# EAGLE design SICK_GL6_P0511S21 (EAGLE 9.4.0)
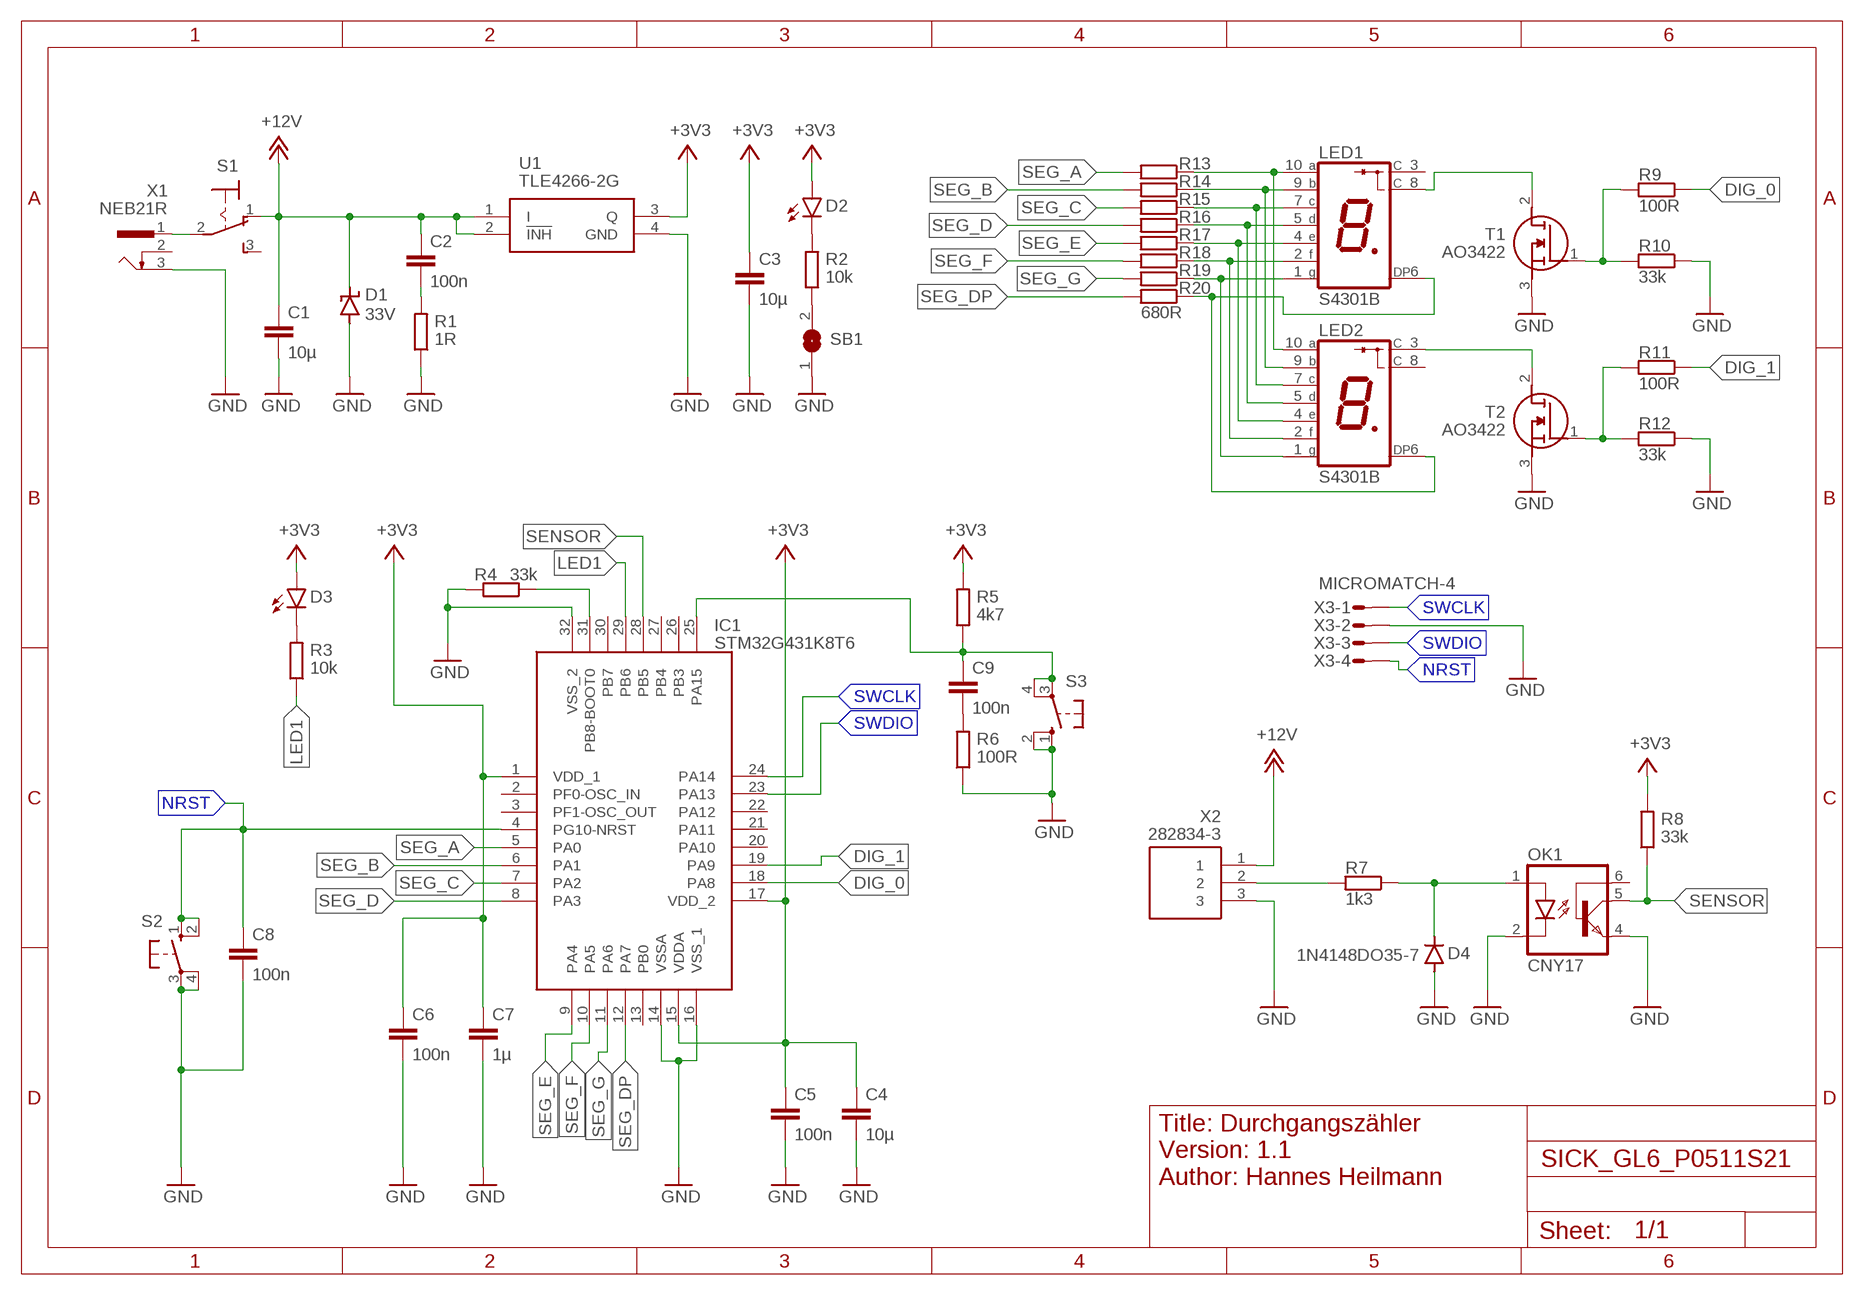
[diagram p0: schematic, sheet 1]

## Parts
C1  10µ  C-EUC1206K  [C1206K]
C2  100n  C-EUC0805K  [C0805K]
C3  10µ  C-EUC1206K  [C1206K]
C4  10µ  C-EUC1206K  [C1206K]
C5  100n  C-EUC0805K  [C0805K]
C6  100n  C-EUC0805K  [C0805K]
C7  1µ  C-EUC1206K  [C1206K]
C8  100n  C-EUC0805K  [C0805K]
C9  100n  C-EUC0805K  [C0805K]
D1  33V  SUPPRESSOR-SMBJ  [SMBJ]
D2  LEDSML0805  [SML0805]
D3  LEDSML0805  [SML0805]
D4  1N4148DO35-7  [DO35-7]
IC1  STM32G431K8T6  [QFP80P900X900X160-32N]
LED1  S4301B  [S4301B]
LED2  S4301B  [S4301B]
OK1  CNY17  [DIL06]
R1  1R  R-EU_R0805  [R0805]
R2  10k  R-EU_R0805  [R0805]
R3  10k  R-EU_R0805  [R0805]
R4  33k  R-EU_R0805  [R0805]
R5  4k7  R-EU_R0805  [R0805]
R6  100R  R-EU_R0805  [R0805]
R7  1k3  R-EU_R0805  [R0805]
R8  33k  R-EU_R0805  [R0805]
R9  100R  R-EU_R0805  [R0805]
R10  33k  R-EU_R0805  [R0805]
R11  100R  R-EU_R0805  [R0805]
R12  33k  R-EU_R0805  [R0805]
R13  680R  R-EU_R0805  [R0805]
R14  680R  R-EU_R0805  [R0805]
R15  680R  R-EU_R0805  [R0805]
R16  680R  R-EU_R0805  [R0805]
R17  680R  R-EU_R0805  [R0805]
R18  680R  R-EU_R0805  [R0805]
R19  680R  R-EU_R0805  [R0805]
R20  680R  R-EU_R0805  [R0805]
S1  M9040P  [M9040P]
S2  10-XX  [B3F-10XX]
S3  10-XX  [B3F-10XX]
SB1  SJ  [SJ]
T1  AO3422  [SOT95P237X112-3N]
T2  AO3422  [SOT95P237X112-3N]
U1  TLE4266-2G  [SOT230P700X170-4N]
X1  NEB21R  [NEB21R]
X2  282834-3  [SHDR3W100P0X254_1X3_808X650X10]
X3  MICROMATCH-4  [MICROMATCH-4]

## Nets
+3V3: C3.1 C4.1 C5.1 C6.1 C7.1 D2.A D3.A IC1.1(VDD_1) IC1.15(VDDA) IC1.17(VDD_2) R5.2 R8.2 U1.3(Q)
+12V: C1.1 C2.1 D1.C S1.1(O) U1.1(I) U1.2(!INH) X2.1
DIG_0: IC1.18(PA8) R9.1
DIG_1: IC1.19(PA9) R11.1
GND: C1.2 C3.2 C4.2 C5.2 C6.2 C7.2 C8.2 D1.A D4.A IC1.14(VSSA) IC1.16(VSS_1) IC1.32(VSS_2) OK1.2(C) OK1.4(EMI) R1.1 R4.2 R6.1 R10.1 R12.1 S2.3(P) S2.4(P1) S3.1(S) S3.2(S1) SB1.1 T1.3(S) T2.3(S) U1.4(GND) X1.3 X2.3 X3.2
LED1: IC1.29(PB6) R3.1
N$1: S1.2(P) X1.1
N$2: C2.2 R1.2
N$3: D4.C OK1.1(A) R7.1
N$4: LED2.3(C) T2.2(D)
N$5: D2.C R2.2
N$6: R7.2 X2.2
N$7: C9.1 IC1.25(PA15) R5.1 S3.3(P) S3.4(P1)
N$8: C9.2 R6.2
N$9: LED1.8(C) T1.2(D)
N$10: IC1.31(PB8-BOOT0) R4.1
N$11: R2.1 SB1.2
N$12: R11.2 R12.2 T2.1(G)
N$13: R9.2 R10.2 T1.1(G)
N$14: D3.C R3.2
NRST: C8.1 IC1.4(PG10-NRST) S2.1(S) S2.2(S1) X3.4
S_A: LED1.10(A) LED2.10(A) R13.1
S_B: LED1.9(B) LED2.9(B) R14.1
S_C: LED1.7(C) LED2.7(C) R15.1
S_D: LED1.5(D) LED2.5(D) R16.1
S_DP: LED1.6(DP) LED2.6(DP) R20.1
S_E: LED1.4(E) LED2.4(E) R17.1
S_F: LED1.2(F) LED2.2(F) R18.1
S_G: LED1.1(G) LED2.1(G) R19.1
SEG_A: IC1.5(PA0) R13.2
SEG_B: IC1.6(PA1) R14.2
SEG_C: IC1.7(PA2) R15.2
SEG_D: IC1.8(PA3) R16.2
SEG_DP: IC1.12(PA7) R20.2
SEG_E: IC1.9(PA4) R17.2
SEG_F: IC1.10(PA5) R18.2
SEG_G: IC1.11(PA6) R19.2
SENSOR: IC1.28(PB5) OK1.5(COL) R8.1
SWCLK: IC1.24(PA14) X3.1
SWDIO: IC1.23(PA13) X3.3
Unconnected: IC1.2(PF0-OSC_IN) IC1.3(PF1-OSC_OUT) IC1.13(PB0) IC1.20(PA10) IC1.21(PA11) IC1.22(PA12) IC1.26(PB3) IC1.27(PB4) IC1.30(PB7) LED1.3(C) LED2.8(C) OK1.6(BAS) S1.3(S) X1.2

## Notes on the sheet
- Title: Durchgangszähler
  Version: 1.1
  Author: Hannes Heilmann

## Library data of the parts
C1-C9 = rcl:C-EU: CAPACITOR, European symbol; SPICEPREFIX: C
D1 = diode:SUPPRESSOR-: Suppressor diode
D2 D3 = led:LED: LED OSRAM: - CHIPLED LG R971, LG N971, LY N971, LG Q971, LY Q971, LO R971, LY R971 LH N974, LH R974 LS Q976, LO Q976, LY Q976 LO Q996 - Hyper CHIPLED LW Q18S LB Q993, LB Q99A, LB R99A - SideLED LS A670, LO A670, LY A670, LG A670, LP A670 LB A673, LV A673, LT A673, LW A673 LH A674 LY A675 LS A676, LA A676, LO A676, LY A676, LW A676 LS A679, LY A679, LG A679 - Hyper Micro SIDELED® LS Y876, LA Y876, LO Y876, LY Y876 LT Y87S - SmartLED LW L88C, LW L88S LB L89C, LB L89S, LG L890 LS L89K, LO L89K, LY L89K LS L896, LA L896, LO L896, LY L896 - TOPLED LS T670, LO T670, LY T670, LG T670, LP T670 LSG T670, LSP T670, LSY T670, LOP T670, LYG T670 LG T671, LOG T671, LSG T671 LB T673, LV T673, LT T673, LW T673 LH T674 LS T676, LA T676, LO T676, LY T676, LB T676, LH T676, LSB T676, LW T676 LB T67C, LV T67C, LT T67C, LS T67K, LO T67K, LY T67K, LW E67C LS E67B, LA E67B, LO E67B, LY E67B, LB E67C, LV E67C, LT E67C LW T67C LS T679, LY T679, LG T679 LS T770, LO T770, LY T770, LG T770, LP T770 LB T773, LV T773, LT T773, LW T773 LH T774 LS E675, LA E675, LY E675, LS T675 LS T776, LA T776, LO T776, LY T776, LB T776 LHGB T686 LT T68C, LB T68C - Hyper Mini TOPLED® LB M676 - Mini TOPLED Santana® LG M470 LS M47K, LO M47K, LY M47K Source: http://www.osram.convergy.de LUXEON: - LUMILED® LXK2-PW12-R00, LXK2-PW12-S00, LXK2-PW14-U00, LXK2-PW14-V00 LXK2-PM12-R00, LXK2-PM12-S00, LXK2-PM14-U00 LXK2-PE12-Q00, LXK2-PE12-R00, LXK2-PE12-S00, LXK2-PE14-T00, LXK2-PE14-U00 LXK2-PB12-K00, LXK2-PB12-L00, LXK2-PB12-M00, LXK2-PB14-N00, LXK2-PB14-P00, LXK2-PB14-Q00 LXK2-PR12-L00, LXK2-PR12-M00, LXK2-PR14-Q00, LXK2-PR14-R00 LXK2-PD12-Q00, LXK2-PD12-R00, LXK2-PD12-S00 LXK2-PH12-R00, LXK2-PH12-S00 LXK2-PL12-P00, LXK2-PL12-Q00, LXK2-PL12-R00 Source: www.luxeon.com KINGBRIGHT: KA-3528ASYC Source: www.kingbright.com
D4 = diode:1N4148: DIODE high speed (Philips)
IC1 = SamacSys_Parts:STM32G431K8T6: STMICROELECTRONICS - STM32G431K8T6 - ARM MCU, STM32 Family STM32G4 Series Microcontrollers, ARM Cortex-M4F, 32bit, 170 MHz, 64 KB, 32 KB Source: Datasheet <https://www.st.com/resource/en/datasheet/stm32g431c6.pdf>; ARROW_PART_NUMBER: STM32G431K8T6; ARROW_PRICE-STOCK: https://www.arrow.com/en/products/stm32g431k8t6/stmicroelectronics; DESCRIPTION: STMICROELECTRONICS - STM32G431K8T6 - ARM MCU, STM32 Family STM32G4 Series Microcontrollers, ARM Cortex-M4F, 32bit, 170 MHz, 64 KB, 32 KB; HEIGHT: 1.6mm; MANUFACTURER_NAME: STMicroelectronics; MANUFACTURER_PART_NUMBER: STM32G431K8T6; MOUSER_PART_NUMBER: 511-STM32G431K8T6; MOUSER_PRICE-STOCK: https://www.mouser.co.uk/ProductDetail/STMicroelectronics/STM32G431K8T6?qs=uwxL4vQweFOdPzJwuo6fkQ%3D%3D
LED1 LED2 = led-7-segment:S4301B: Single Digit Seven-Segment Display (cathode common) Source: LITEON .. S4301B.pdf; OC_FARNELL: unknown; OC_NEWARK: unknown
OK1 = optocoupler:CNY17: SIEMENS OPTO COUPLER; MPN: CNY17-1; OC_FARNELL: 1045399; OC_NEWARK: 05M4044
R1-R20 = rcl:R-EU_: RESISTOR, European symbol; SPICEPREFIX: R
S1 = switch:M9040P: TOGGLE SWITCH Marquardt
S2 S3 = switch-omron:10-XX: OMRON SWITCH; MPN: B3F-1000; OC_FARNELL: 176432; OC_NEWARK: 36M3542
SB1 = jumper:SJ: SMD solder JUMPER
T1 T2 = SamacSys_Parts:AO3422: MOSFET N-CH 55V 2.1A SOT23 Source: Datasheet <http://aosmd.com/res/data_sheets/AO3422.pdf>; ARROW_PART_NUMBER: AO3422; ARROW_PRICE-STOCK: https://www.arrow.com/en/products/ao3422/alpha-and-omega-semiconductor?region=nac; DESCRIPTION: MOSFET N-CH 55V 2.1A SOT23; HEIGHT: 1.12mm; MANUFACTURER_NAME: Alpha & Omega Semiconductors; MANUFACTURER_PART_NUMBER: AO3422
U1 = SamacSys_Parts:TLE4266-2G: Infineon TLE4266-2G, LDO Voltage Regulator, 150mA, 5 V +/-3%, 5.5 45 Vin, 3+Tab-Pin SOT-223 Source: Datasheet <http://www.infineon.com/dgdl/Infineon-TLE4266-2-DS-v01_40-EN.pdf?fileId=5546d46259d9a4bf0159f94369cf3e1b>; DESCRIPTION: Infineon TLE4266-2G, LDO Voltage Regulator, 150mA, 5 V +/-3%, 5.5 45 Vin, 3+Tab-Pin SOT-223; HEIGHT: 1.7mm; MANUFACTURER_NAME: Infineon; MANUFACTURER_PART_NUMBER: TLE4266-2G; MOUSER_PART_NUMBER: 726-TLE42662G; MOUSER_PRICE-STOCK: https://www.mouser.com/Search/Refine.aspx?Keyword=726-TLE42662G
X1 = SamacSys_Parts:NEB21R: Netzgeräte-Einbaukupplung abgewinkelte Ausführung mit Öffner Source: http://www.lumberg.com/Produkte/PDFs/NEB21R.pdf; MPN: NEB 21 R; OC_FARNELL: 1217037; OC_NEWARK: 97K6458
X2 = SamacSys_Parts:282834-3: Connector pcb 3 way 2.54mm Termi-Block Source: Datasheet <http://www.te.com/commerce/DocumentDelivery/DDEController?Action=showdoc&DocId=Customer Drawing282834C1pdfEnglishENG_CD_282834_C1.pdf282834-3>; ALLIED_NUMBER: 70087777; ALLIED_PRICE-STOCK: http://www.alliedelec.com/te-connectivity-282834-3/70087777/; DESCRIPTION: Connector pcb 3 way 2.54mm Termi-Block; HEIGHT: 10.3mm; MANUFACTURER_NAME: TE Connectivity; MANUFACTURER_PART_NUMBER: 282834-3; MOUSER_PART_NUMBER: 571-2828343; MOUSER_PRICE-STOCK: https://www.mouser.com/Search/Refine.aspx?Keyword=571-2828343; RS_PART_NUMBER: 1640792; RS_PRICE-STOCK: http://uk.rs-online.com/web/p/products/1640792
X3 = con-amp-micromatch:MICROMATCH-4: MicroMaTch 4 7-215464-4 / 0-215464-4 Drawing Number C-215464 DDEController.pdf; MPN: 7-215464-4; OC_FARNELL: 3784629; OC_NEWARK: 19R8124

## Board
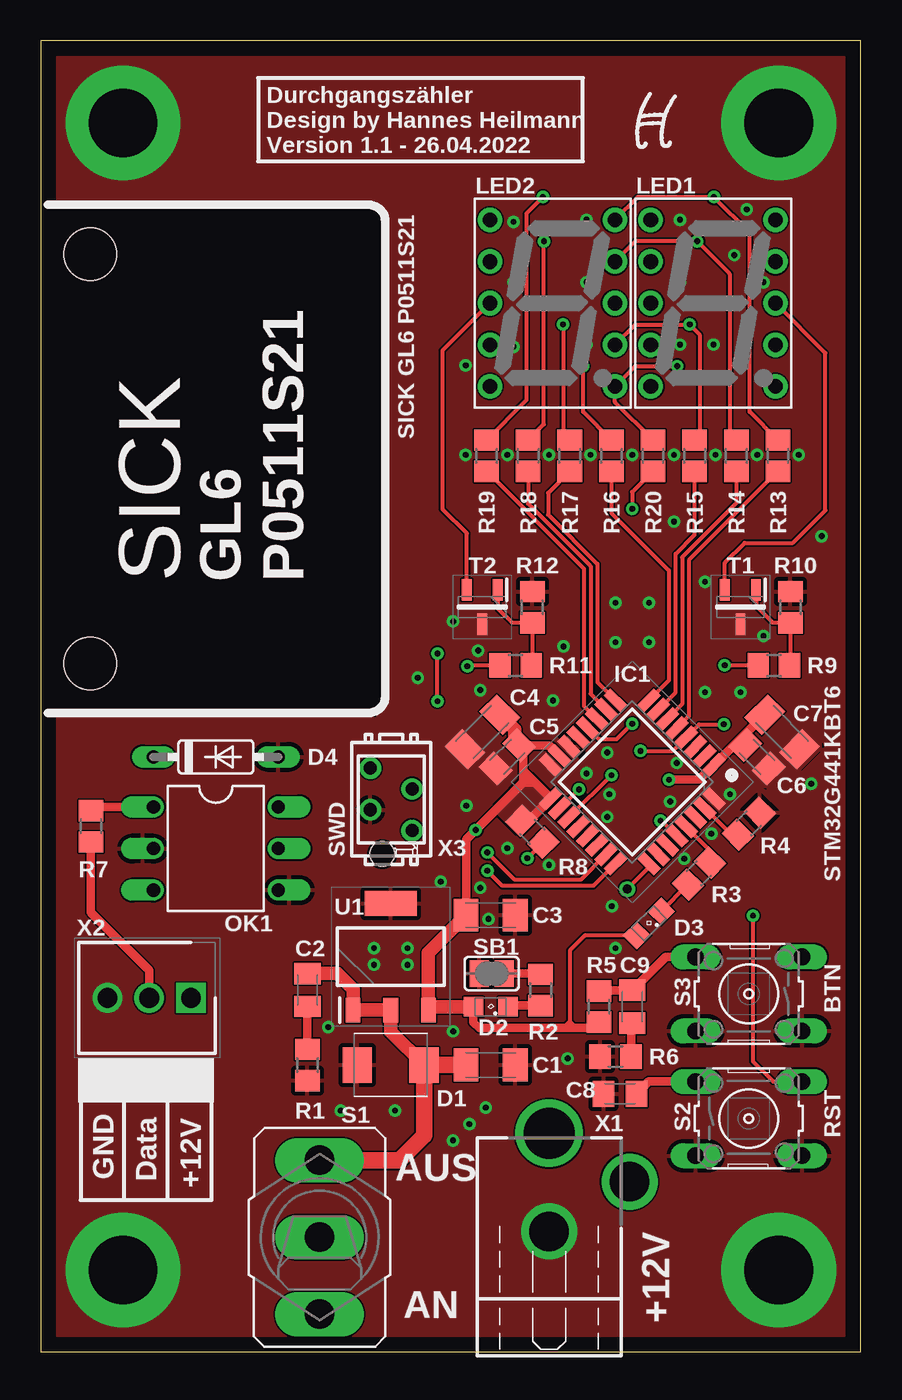
[diagram p1: board, top side]
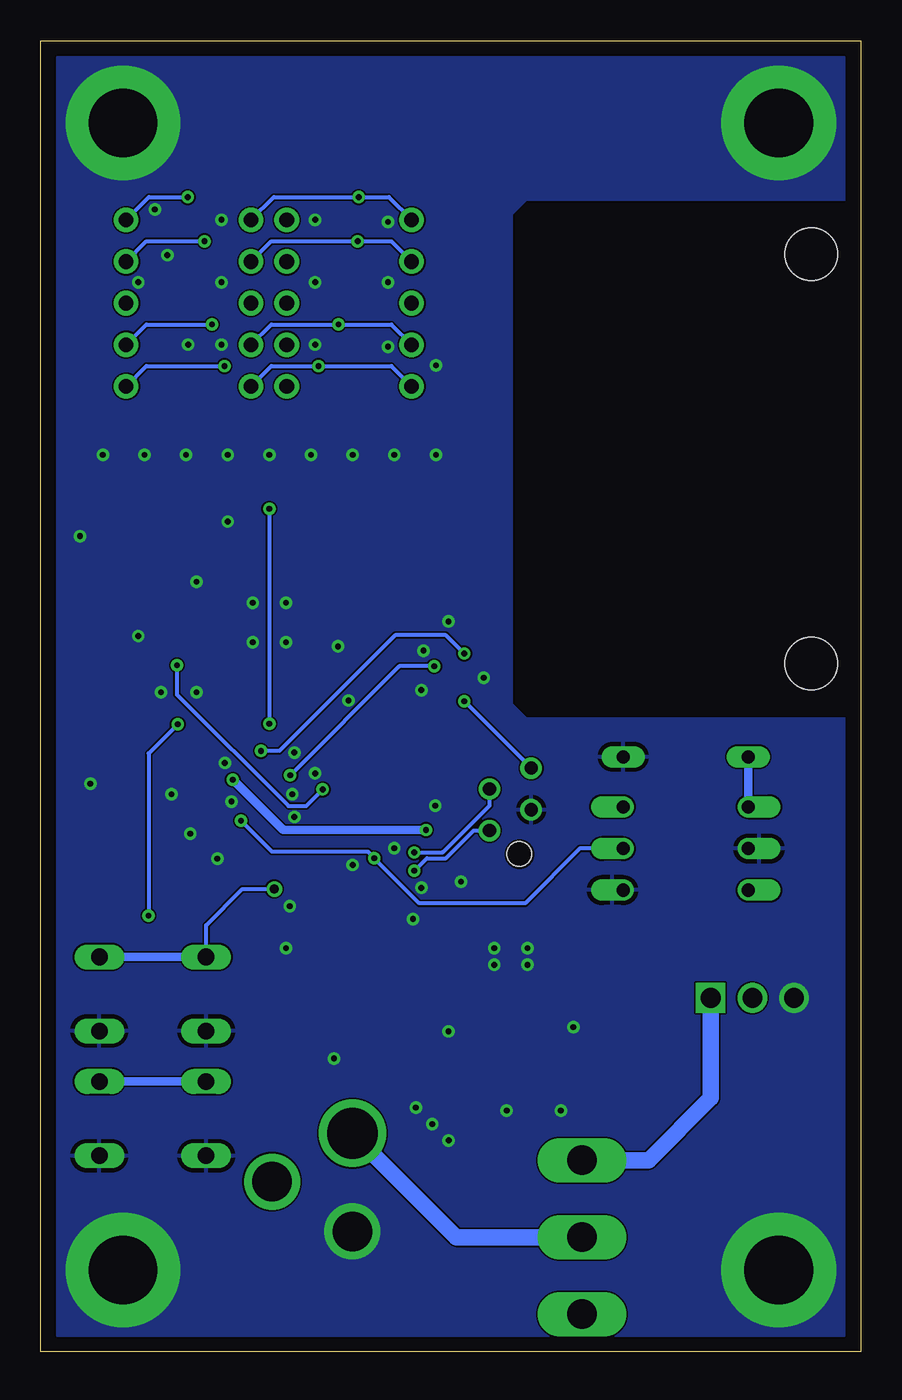
[diagram p2: board, bottom side, seen from below]

Size 50 x 80 mm. Coordinates in mm from the lower left corner, seen from the top.
Outline: 0,80 0,0 50,0 50,80 0,80
Copper layers (1*16): Top 0.035mm / dielectric 1.5mm / Bottom 0.035mm
Design rules "default *": minimum track width 2mil, minimum drill 0.35mm, track to track 4mil, track to pad 4mil, pad to pad 4mil, via to via 4mil, smd to smd 4mil, copper to edge 6mil, drill to drill 2mil, minimum pad ring 10mil, minimum via ring 8mil, stop-mask expansion 2mil, vias tented up to drill 0mil, thermal gap 10mil
Holes 3.2 mm at 3,67 3,42
tRestrict: area 0.8,38.9 to 21.1,70.1
bRestrict: area 0.8,38.9 to 21.1,70.1

### Footprints (pad centres in the part's own frame; a part is rotated, then mirrored left to right if it is on the bottom)
C1206K = smd 1.5 x 2: 1 -1.5,0; 2 1.5,0
C0805K = smd 1.3 x 1.6: 1 -1,0; 2 1,0
SMBJ = smd 1.78 x 2.16: A 2.04,0; C -2.03,0
SML0805 = smd 1.2 x 1.2: A 1.05,0; C -1.05,0
DO35-7 = drill 0.813 long: A 3.81,0; C -3.81,0
QFP80P900X900X160-32N = smd 1.475 x 0.6: 1 -4.238,2.8; 2 -4.238,2; 3 -4.238,1.2; 4 -4.238,0.4; 5 -4.238,-0.4; 6 -4.238,-1.2; 7 -4.238,-2; 8 -4.238,-2.8; 17 4.238,-2.8; 18 4.238,-2; 19 4.238,-1.2; 20 4.238,-0.4; 21 4.238,0.4; 22 4.238,1.2; 23 4.238,2; 24 4.238,2.8 | smd 0.6 x 1.475: 9 -2.8,-4.238; 10 -2,-4.238; 11 -1.2,-4.238; 12 -0.4,-4.238; 13 0.4,-4.238; 14 1.2,-4.238; 15 2,-4.238; 16 2.8,-4.238; 25 2.8,4.238; 26 2,4.238; 27 1.2,4.238; 28 0.4,4.238; 29 -0.4,4.238; 30 -1.2,4.238; 31 -2,4.238; 32 -2.8,4.238
S4301B = drill 0.9 pad 1.5: 1 -3.81,5.08; 2 -3.81,2.54; 3 -3.81,0; 4 -3.81,-2.54; 5 -3.81,-5.08; 6 3.81,-5.08; 7 3.81,-2.54; 8 3.81,0; 9 3.81,2.54; 10 3.81,5.08
DIL06 = drill 0.813 offset: 1 -2.54,-3.81; 2 0,-3.81; 3 2.54,-3.81; 4 2.54,3.81; 5 0,3.81; 6 -2.54,3.81
R0805 = smd 1.3 x 1.5: 1 -0.95,0; 2 0.95,0
M9040P = drill 1.803 long: 1 0,4.699; 2 0,0; 3 0,-4.699
B3F-10XX = drill 1.016 long: 1 -3.251,2.261; 2 3.251,2.261; 3 -3.251,-2.261; 4 3.251,-2.261
SJ = smd 1.168 x 1.6: 1 -0.762,0; 2 0.762,0
SOT95P237X112-3N = smd 1.3 x 0.6: 1 -1.05,0.95; 2 -1.05,-0.95; 3 1.05,0
SOT230P700X170-4N = smd 1.5 x 0.9: 1 -3.25,2.3; 2 -3.25,0; 3 -3.25,-2.3 | smd 1.5 x 3.2: 4 3.25,0
NEB21R = drill 3.1: 1 0,7.341 | drill 2.4: 2 4.902,4.394; 3 0,1.346
SHDR3W100P0X254_1X3_808X650X10 = drill 1.2 pad 1.8 square: 1 0,0 | drill 1.2 pad 1.8: 2 2.54,0; 3 5.08,0
MICROMATCH-4 = drill 0.8: 1 1.905,1.27; 2 0.635,-1.27; 3 -0.635,1.27; 4 -1.905,-1.27 | hole 1.5: 3.34,-0.55

### Placement (x,y rotation side)
C1  27.43,17.51 0 top
C2  16.26,22.08 270 top
C3  27.43,26.66 0 top
C4  26.92,37.83 225 top
C5  28.45,36.31 225 top
C6  43.69,36.31 315 top
C7  45.21,37.83 315 top
C8  35.32,15.75 180 top
C9  36.07,21.07 270 top
D1  21.34,17.51 180 top
D2  27.43,21.07 180 top
D3  37.08,26.15 225 top
D4  10.67,36.31 0 top
IC1  36.07,34.78 225 top
LED1  41,64 0 top
LED2  31.2,64 0 top
OK1  10.67,30.72 270 top
R1  16.26,17.51 90 top
R2  30.48,22.08 270 top
R3  40.13,29.2 225 top
R4  43.18,32.24 45 top
R5  34.04,21.07 270 top
R6  35.05,18.02 0 top
R7  3.05,32.07 270 top
R8  29.97,31.74 135 top
R9  44.7,41.9 0 top
R10  45.72,45.45 270 top
R11  28.96,41.9 0 top
R12  29.97,45.45 270 top
R13  44.96,54.7 270 top
R14  42.42,54.7 270 top
R15  39.88,54.7 270 top
R16  34.8,54.7 270 top
R17  32.26,54.7 270 top
R18  29.72,54.7 270 top
R19  27.18,54.7 270 top
R20  37.34,54.7 270 top
S1  17,7 0 top
S2  43.18,14.24 0 top
S3  43.18,21.84 180 top
SB1  27.5,23.08 0 top
T1  42.67,45.45 270 top
T2  26.92,45.45 270 top
U1  21.34,24.12 90 top
X1  31,6 0 top
X2  9.14,21.6 180 top
X3  21.37,33.72 270 top

### Tracks (layer width: path | path; a pad name or v marks a point on that pad's centre or on a via)
+3V3  (via drill 0.35)
  Top 0.254: D3.A 33.17,25.41 32.26,24.49 32.26,20.17 | 31.85,19.76 32.26,20.17 | 32.26,20.17 32.56,19.86 32.56,19.76
  Top 0.508: IC1.15 31.01,37.02 C5.1 29.41,36.76 29.41,35.45 | R8.2 29.73,32.41 IC1.17 30.11,34.75 | C3.1 25.93,31.27 v26.52,31.85 29.41,34.75 | 29.41,34.75 29.41,35.45 | 30.11,34.75 29.41,34.75 | 30.11,34.75 29.41,35.45 | D2.A 26.38,20.1 26.72,19.76 31.85,19.76 32.56,19.76 33.68,19.76 R5.2 | v38.3,34.92 40.17,34.92 IC1.1 42.26,37.02 42.27,37.02 | 42.27,37.02 C6.1 | C7.1 42.27,37.02
  Top 0.813: D2.A 23.84,21.07 U1.3 23.64,24.36 C3.1 | C5.1 28.91,37.27 28.91,37.97 C4.1
  Bottom 0.508: v38.3,34.92 35.23,31.85 v26.52,31.85
  pour Top (no thermals): 29.21,31.8 27.84,33.17 29.77,35.1 31.14,33.73
+12V
  Top 0.813: D1.C 21.34,19.54 U1.2 U1.1 19.04,22.14 18.09,23.08 C2.1
  Top 1.016: C1.1 D1.C 23.37,13.21 21.86,11.7 S1.1
  Bottom 1.016: X2.1 9.14,15.49 12.94,11.7 S1.1
DIG_0  (via drill 0.35)
  Top 0.254: R9.1 | R9.1 v41.71,41.9 | v32.82,34.33 31.69,33.2 IC1.18
  Bottom 0.254: v32.82,34.33 33.83,33.31 34.9,33.31 41.71,40.12 v41.71,41.9
DIG_1  (via drill 0.35)
  Top 0.254: R11.1 26.06,41.9 v26.01,41.84 | v34.8,35.19 34.78,35.19 IC1.19
  Bottom 0.254: v26.01,41.84 28.14,41.84 v34.8,35.19
GND  (via drill 0.35, 4.2 pad 7)
  other vias: 45,75 5,75 5,5 45,5 18.29,14.73 20.32,23.62 22.35,23.62 22.35,24.64 20.32,24.64 25.15,19.56 34.82,27.2 21.59,14.73 17.53,19.81 24.38,28.7 28.45,30.73 30.99,29.72 26.8,28.32 27.3,26.42 39.24,30.1 40.89,31.62 42.04,34.04 34.67,34.04 34.54,36.58 33.27,35.31 31.24,39.75 31.88,43.05 26.67,42.8 26.8,40.39 25.15,44.58 22.99,41.15 25.91,54.74 25.91,60.2 28.83,61.34 33.27,61.47 28.45,54.74 30.99,54.74 33.53,54.74 36.07,54.74 38.61,54.74 41.15,54.74 43.69,54.74 46.23,54.74 37.08,45.72 37.08,43.31 35.05,43.31 35.05,45.72 38.61,50.67 44.07,43.69 40.51,46.99 46.99,34.67 32.13,17.91 35.05,24.64 40.51,40.26 42.67,40.26 47.62,49.78 38.99,61.47 41.02,61.47 38.99,65.28 33.27,65.28 28.83,65.28 28.83,68.96 33.27,69.09 38.99,69.09 42.29,66.93 43.05,69.72 44.07,65.28 25.95,33.33 38.38,33.59 34.55,32.65 38.79,35.94 27.13,14.91 25.13,12.91 26.13,13.91
  pour Top (rank 2): 1,79 1,1 49,1 49,79
  pour Bottom: 1,79 1,1 49,1 49,79
  pour Top (no thermals): 24.23,36.63 26.62,34.24 27.89,34.24 29.82,36.17 31.34,34.65 32.36,34.65 33.22,33.78 40.44,33.78 41.25,32.97 41.55,32.97 43.13,34.54 45.26,34.54 47.55,36.83 47.55,37.39 46.38,38.56 44.25,38.56 43.74,38.05 42.47,38.05 39.73,35.31 33.58,35.31 29.51,39.37 26.62,39.37 24.23,36.98
  pour Top (no thermals): 25.91,45.47 27.94,45.47 27.94,43.18 25.91,43.18
  pour Top (no thermals): 41.91,45.47 43.69,45.47 43.69,43.18 41.66,43.18 41.66,45.47
  pour Bottom (no thermals): 28.7,9.78 33.4,9.78 33.4,5.08 28.7,5.08
  pour Top (no thermals): 2.92,23.11 5.46,23.11 5.46,20.19 2.79,20.19 2.79,23.11
  pour Bottom (no thermals): 2.92,23.11 5.46,23.11 5.46,20.19 2.79,20.19 2.79,23.11
  pour Top (no thermals): 28.7,9.78 33.4,9.78 33.4,5.08 28.7,5.08
LED1
  Top 0.254: IC1.29 40.8,30.61 R3.1
N$1
  Bottom 1.016: X1.1 24.66,7 S1.2
N$2
  Top 0.508: R1.2 C2.2
N$3
  Top 0.508: R7.1 3.29,33.26 OK1.1
  Bottom 0.508: D4.C OK1.1
N$4
  Top 0.254: T2.2 25.97,49.96 24.49,51.45 24.49,61.1 LED2.3
N$5
  Top 0.508: D2.C 28.55,21.13 R2.2
N$6
  Top 0.508: X2.2 6.6,23.27 3.05,26.82 R7.2
N$7  (via drill 0.55)
  Top 0.254: v35.76,28.25 37.09,29.57 IC1.25
  Top 0.508: R5.1 34.09,22.07 C9.1 38.1,24.11 S3.4
  Bottom 0.254: S3.4 39.93,26.04 37.72,28.25 v35.76,28.25
  Bottom 0.508: S3.4 S3.3
N$8
  Top 0.508: R6.2 36,20 C9.2
N$9
  Top 0.254: T1.2 41.72,48.16 42.93,49.36 45.87,49.36 47.85,51.34 47.85,60.96 LED1.8
N$10
  Top 0.254: IC1.31 42.11,31.57 R4.1
N$11
  Top 0.508: SB1.2 30.43,23.08 R2.1
N$12
  Top 0.254: T2.1 27.87,45.37 28.74,44.5 R12.2 29.97,41.96 R11.2
N$13
  Top 0.254: T1.1 43.62,45.52 44.64,44.5 R10.2 45.72,41.96 R9.2
N$14
  Top 0.254: D3.C R3.2
NRST  (via drill 0.35)
  Top 0.254: v24.18,39.71 v24.18,42.62 | v36.58,36.68 38.53,36.68 IC1.4 40.15,38.3 v41.66,38.3 | v43.43,26.62 43.43,17.73 44.66,16.5 S2.2
  Top 0.508: C8.1 37.07,16.5 S2.1
  Bottom 0.254: X3.4 v24.18,39.71 | v24.18,42.62 25.3,43.74 28.4,43.74 35.46,36.68 v36.58,36.68 | v41.66,38.3 43.43,36.52 v43.43,26.62
  Bottom 0.508: S2.2 S2.1
S_A  (via drill 0.35)
  Top 0.254: LED2.10 36.4,70.47 v41.05,70.47 43.23,68.29 43.23,57.37 R13.1
  Bottom 0.254: LED1.10 43.42,70.47 v41.05,70.47
S_B  (via drill 0.35)
  Top 0.254: LED2.9 36.25,67.78 v40.03,67.78 42.01,65.8 42.01,56.05 R14.1
  Bottom 0.254: LED1.9 43.57,67.78 v40.03,67.78
S_C  (via drill 0.35)
  Top 0.254: LED2.7 36.25,62.7 v39.57,62.7 40.18,62.09 40.18,55.95 R15.1
  Bottom 0.254: LED1.7 43.57,62.7 v39.57,62.7
S_D  (via drill 0.35)
  Top 0.254: R16.1 33.07,57.37 v33.07,60.16
  Bottom 0.254: LED1.5 35.95,60.16 v33.07,60.16 28.63,60.16 LED2.5
S_DP  (via drill 0.35)
  Top 0.254: v38.81,60.16 36.25,60.16 LED2.6 35.01,57.97 R20.1
  Bottom 0.254: LED1.6 43.57,60.16 v38.81,60.16
S_E  (via drill 0.35)
  Top 0.254: v31.85,62.7 31.85,56.05 R17.1
  Bottom 0.254: LED1.4 35.95,62.7 v31.85,62.7 28.63,62.7 LED2.4
S_F  (via drill 0.35)
  Top 0.254: R18.1 30.68,56.61 v30.68,67.78
  Bottom 0.254: LED1.2 35.95,67.78 v30.68,67.78 28.63,67.78 LED2.2
S_G  (via drill 0.35)
  Top 0.254: R19.1 29.62,58.08 29.62,69.47 v30.62,70.47
  Bottom 0.254: LED1.1 35.8,70.47 v30.62,70.47 28.78,70.47 LED2.1
SEG_A
  Top 0.254: IC1.5 39.52,38.8 39.52,48.31 R13.2
SEG_B
  Top 0.254: R14.2 42.42,51.81 39.12,48.51 39.12,39.53 IC1.6
SEG_C
  Top 0.254: IC1.7 38.71,40.25 38.71,48.7 39.88,49.87 R15.2
SEG_D
  Top 0.254: R16.2 34.8,51.19 38.3,47.69 38.3,40.98 IC1.8
SEG_DP  (via drill 0.35)
  Top 0.254: IC1.12 34.04,37.38 35.1,37.38 v36.07,38.34 | v36.07,51.45 36.07,52.48 R20.2
  Bottom 0.254: v36.07,51.45 v36.07,38.34
SEG_E
  Top 0.254: R17.2 30.94,52.42 30.94,51.09 33.93,48.09 33.93,40.88 IC1.9
SEG_F
  Top 0.254: R18.2 29.72,51.77 33.53,47.95 33.53,40.15 IC1.10
SEG_G
  Top 0.254: R19.2 33.12,47.8 33.12,39.43 IC1.11
SENSOR  (via drill 0.35)
  Top 0.254: R8.1 30.61,31.06 v29.67,30.12 | v37.8,32.41 37.88,32.41 IC1.28
  Bottom 0.254: OK1.5 17.13,30.72 20.47,27.38 26.92,27.38 v29.67,30.12 30.07,30.53 35.92,30.53 v37.8,32.41
SWCLK  (via drill 0.35)
  Top 0.254: IC1.24 33.69,28.45 28.14,28.45 v27.23,29.36
  Bottom 0.254: v27.23,29.36 26.47,30.12 25.29,30.12 23.6,31.82 X3.1
SWDIO  (via drill 0.35)
  Top 0.254: IC1.23 32.92,28.8 28.91,28.8 v27.23,30.48
  Bottom 0.254: v27.23,30.48 25.5,30.48 22.64,33.34 X3.3

### Text on the board
tPlace: Durchgangszähler / Design by Hannes Heilmann / Version 1.1 - 26.04.2022 | SICK GL6 P0511S21 | SICK | GL6 / P0511S21 | SWD | STM32G441KBT6 | BTN | RST | GND | Data | +12V | AUS | AN | +12V